# Altium schematic sheet Main.SchDoc
size A2
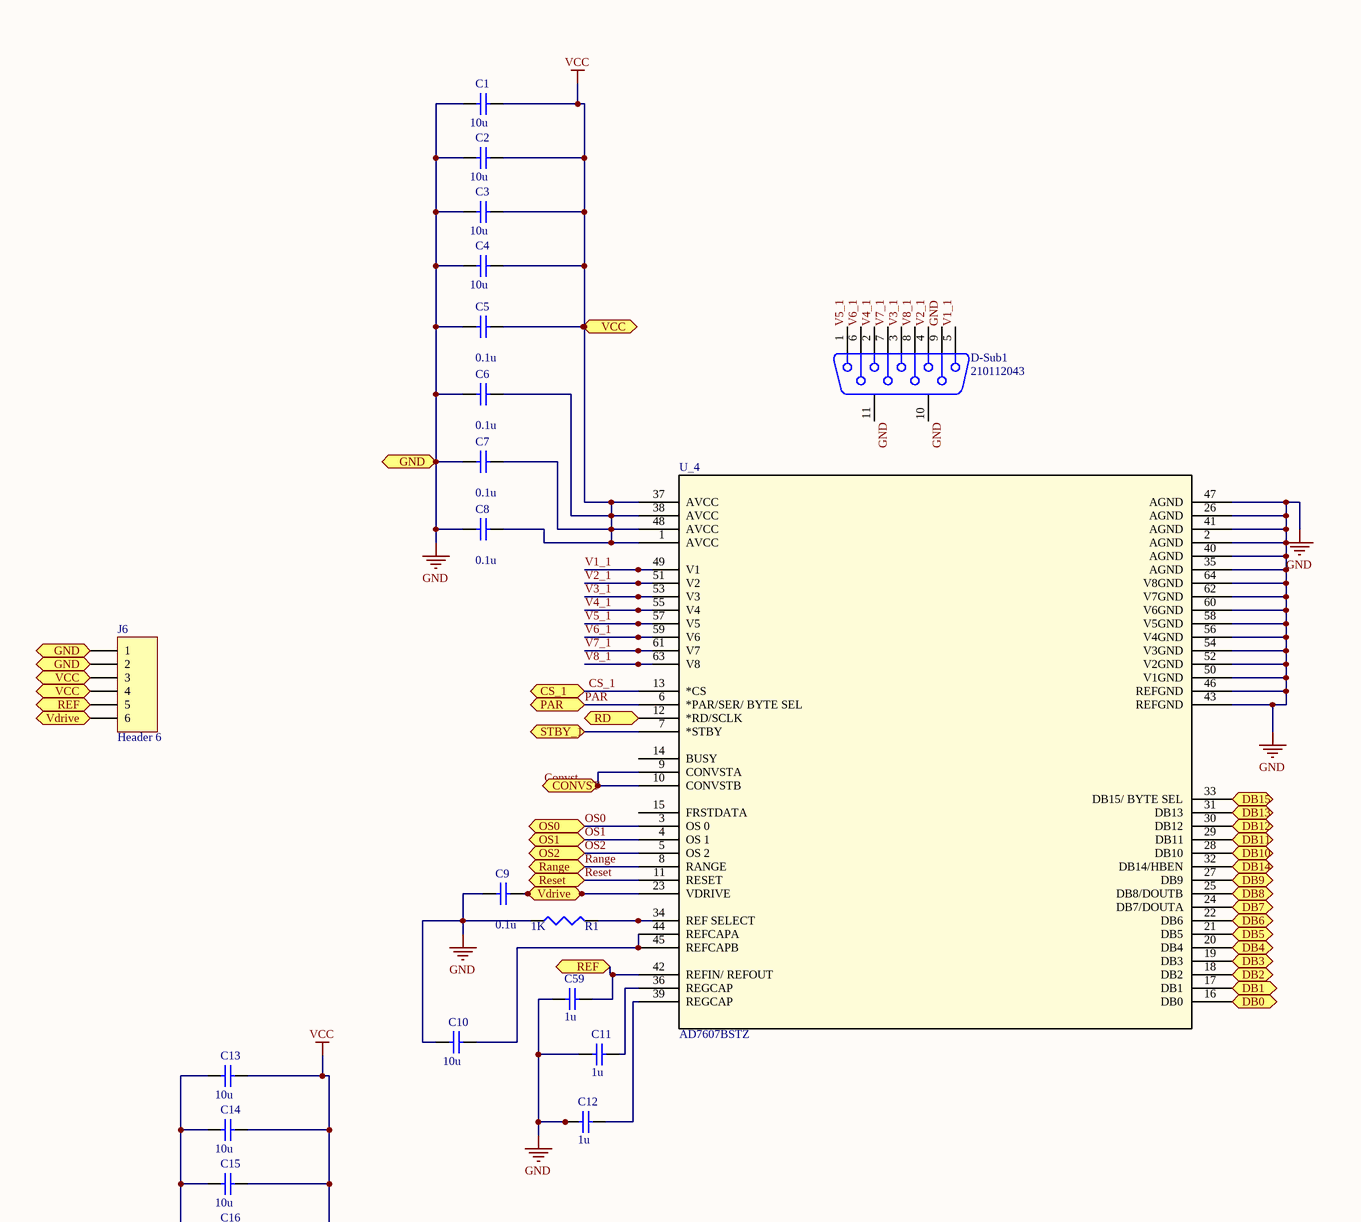
[diagram p0: Main.SchDoc, top left]
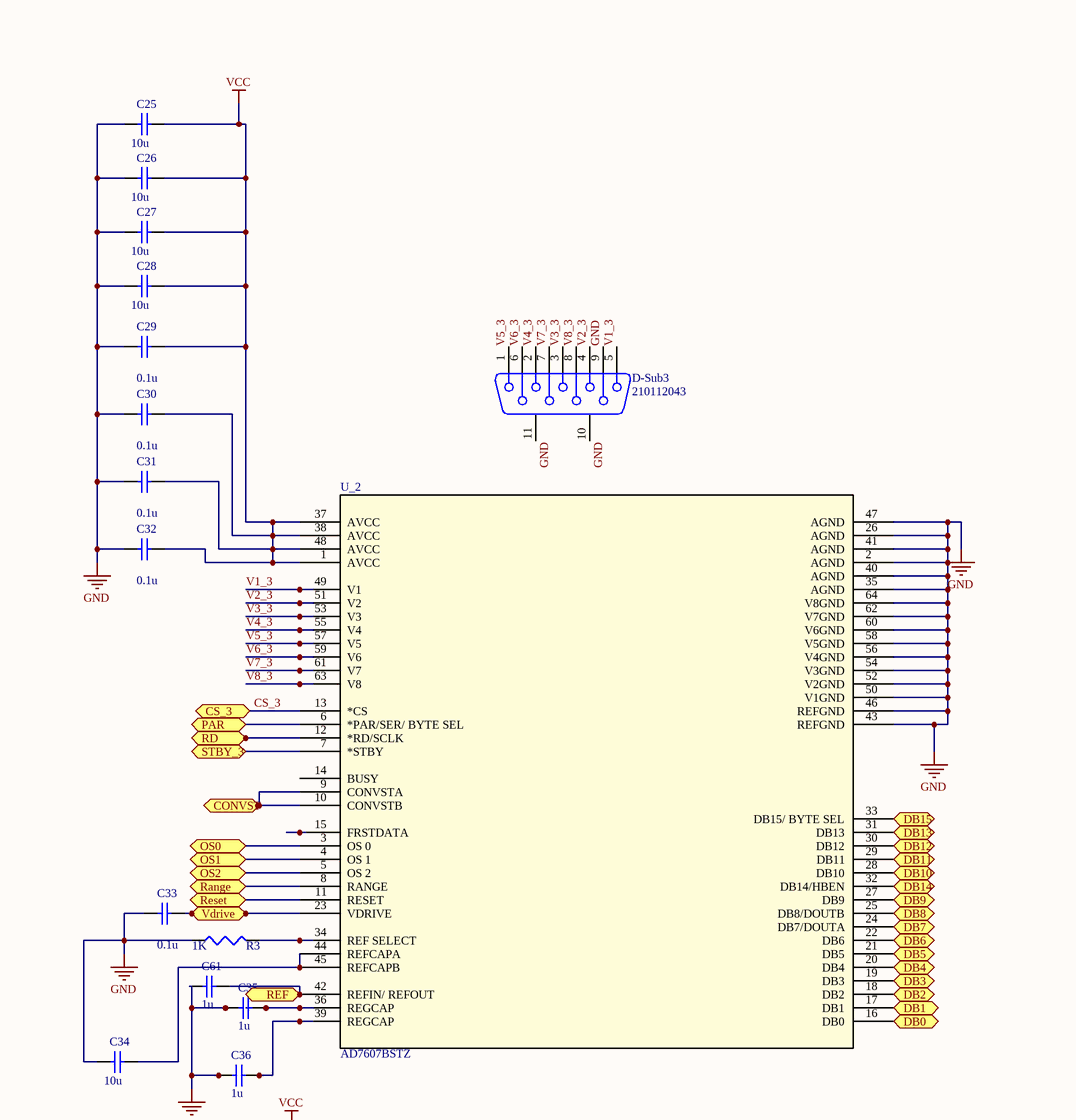
[diagram p1: Main.SchDoc, top right]
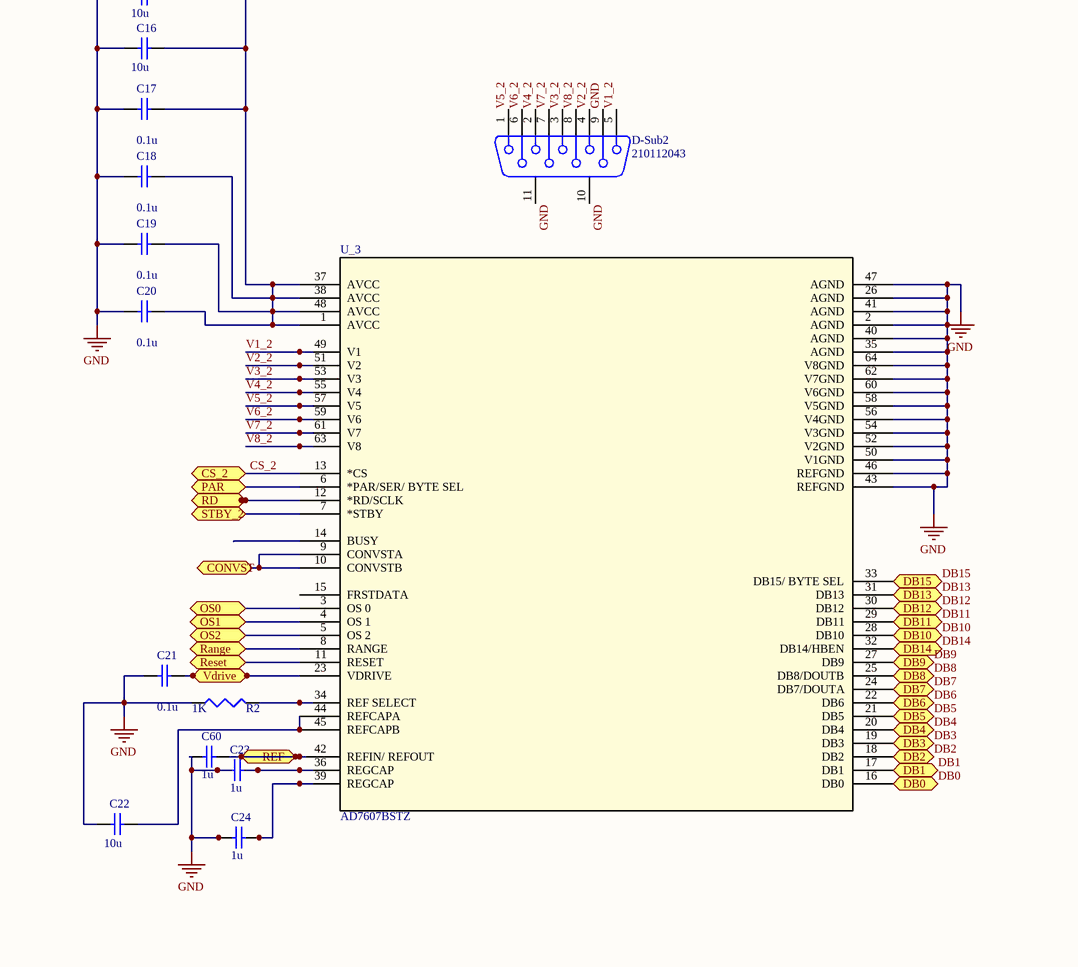
[diagram p2: Main.SchDoc, bottom left]
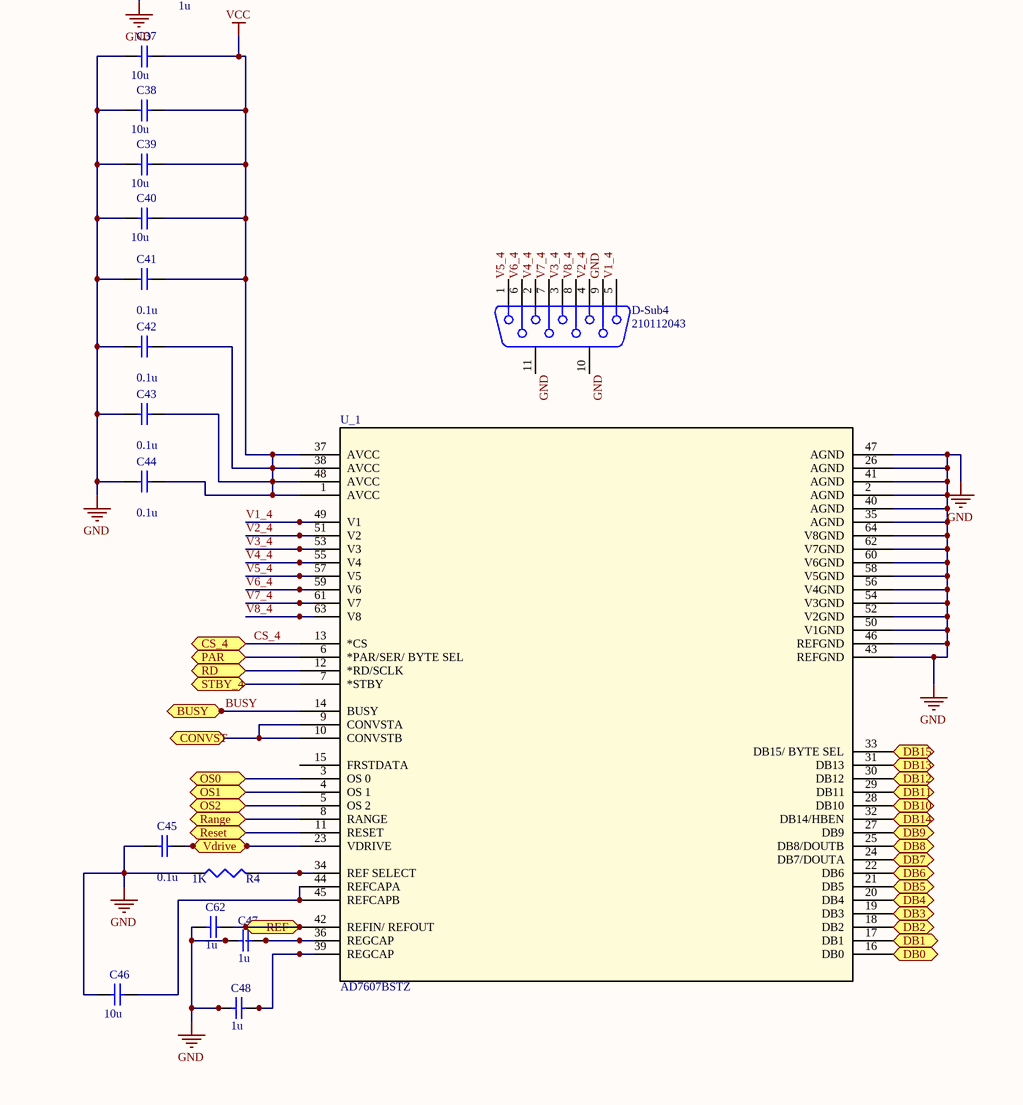
[diagram p3: Main.SchDoc, bottom right]

## Parts
C1  value 10u  [0805]  (hidden comment: C0805)
C2  value 10u  [0805]  (hidden comment: C0805)
C3  value 10u  [0805]  (hidden comment: C0805)
C4  value 10u  [0805]  (hidden comment: C0805)
C5  value 0.1u  [0603]
C6  value 0.1u  [0603]
C7  value 0.1u  [0603]
C8  value 0.1u  [0603]
C9  value 0.1u  [0603]
C10  value 10u  [0805]  (hidden comment: C0805)
C11  value 1u  [0805]  (hidden comment: C0805)
C12  value 1u  [0805]  (hidden comment: C0805)
C13  value 10u  [0805]  (hidden comment: C0805)
C14  value 10u  [0805]  (hidden comment: C0805)
C15  value 10u  [0805]  (hidden comment: C0805)
C16  value 10u  [0805]  (hidden comment: C0805)
C17  value 0.1u  [0603]
C18  value 0.1u  [0603]
C19  value 0.1u  [0603]
C20  value 0.1u  [0603]
C21  value 0.1u  [0603]
C22  value 10u  [0805]  (hidden comment: C0805)
C23  value 1u  [0805]  (hidden comment: C0805)
C24  value 1u  [0805]  (hidden comment: C0805)
C25  value 10u  [0805]  (hidden comment: C0805)
C26  value 10u  [0805]  (hidden comment: C0805)
C27  value 10u  [0805]  (hidden comment: C0805)
C28  value 10u  [0805]  (hidden comment: C0805)
C29  value 0.1u  [0603]
C30  value 0.1u  [0603]
C31  value 0.1u  [0603]
C32  value 0.1u  [0603]
C33  value 0.1u  [0603]
C34  value 10u  [0805]  (hidden comment: C0805)
C35  value 1u  [0805]  (hidden comment: C0805)
C36  value 1u  [0805]  (hidden comment: C0805)
C37  value 10u  [0805]  (hidden comment: C0805)
C38  value 10u  [0805]  (hidden comment: C0805)
C39  value 10u  [0805]  (hidden comment: C0805)
C40  value 10u  [0805]  (hidden comment: C0805)
C41  value 0.1u  [0603]
C42  value 0.1u  [0603]
C43  value 0.1u  [0603]
C44  value 0.1u  [0603]
C45  value 0.1u  [0603]
C46  value 10u  [0805]  (hidden comment: C0805)
C47  value 1u  [0805]  (hidden comment: C0805)
C48  value 1u  [0805]  (hidden comment: C0805)
C59  value 1u  [0805]  (hidden comment: C0805)
C60  value 1u  [0805]  (hidden comment: C0805)
C61  value 1u  [0805]  (hidden comment: C0805)
C62  value 1u  [0805]  (hidden comment: C0805)
D-Sub1  210112043  [WE-DS, 210112043]
D-Sub2  210112043  [WE-DS, 210112043]
D-Sub3  210112043  [WE-DS, 210112043]
D-Sub4  210112043  [WE-DS, 210112043]
J6  Header 6  [HDR1X6]
R1  value 1K  [J1-0603]
R2  value 1K  [J1-0603]
R3  value 1K  [J1-0603]
R4  value 1K  [J1-0603]
U_1  AD7607BSTZ  [ST_64_2]
U_2  AD7607BSTZ  [ST_64_2]
U_3  AD7607BSTZ  [ST_64_2]
U_4  AD7607BSTZ  [ST_64_2]

## Ports
BUSY, CONVST, CS_1, CS_2, CS_3, CS_4, DB0, DB1, DB2, DB3, DB4, DB5, DB6, DB7, DB8, DB9, DB10, DB11, DB12, DB13, DB14, DB15, GND, OS0, OS1, OS2, PAR, Range, RD, REF, Reset, STBY_1, STBY_2, STBY_3, STBY_4, VCC, Vdrive

## Nets
GND: C1.2 C2.2 C3.2 C4.2 C5.1 C6.1 C7.1 C8.1 C9.1 C10.2 C11.2 C12.2 C13.2 C14.2 C15.2 C16.2 C17.1 C18.1 C19.1 C20.1 C21.1 C22.2 C23.2 C24.2 C25.2 C26.2 C27.2 C28.2 C29.1 C30.1 C31.1 C32.1 C33.1 C34.2 C35.2 C36.2 C37.2 C38.2 C39.2 C40.2 C41.1 C42.1 C43.1 C44.1 C45.1 C46.2 C47.2 C48.2 C59.2 C60.2 C61.2 C62.2 D-Sub1.9 D-Sub1.10(MH1) D-Sub1.11(MH2) D-Sub2.9 D-Sub2.10(MH1) D-Sub2.11(MH2) D-Sub3.9 D-Sub3.10(MH1) D-Sub3.11(MH2) D-Sub4.9 D-Sub4.10(MH1) D-Sub4.11(MH2) J6.1 J6.2 R1.1 R2.1 R3.1 R4.1 U_1.2(AGND) U_1.26(AGND) U_1.35(AGND) U_1.40(AGND) U_1.41(AGND) U_1.43(REFGND) U_1.46(REFGND) U_1.47(AGND) U_1.50(V1GND) U_1.52(V2GND) U_1.54(V3GND) U_1.56(V4GND) U_1.58(V5GND) U_1.60(V6GND) U_1.62(V7GND) U_1.64(V8GND) U_2.2(AGND) U_2.26(AGND) U_2.35(AGND) U_2.40(AGND) U_2.41(AGND) U_2.43(REFGND) U_2.46(REFGND) U_2.47(AGND) U_2.50(V1GND) U_2.52(V2GND) U_2.54(V3GND) U_2.56(V4GND) U_2.58(V5GND) U_2.60(V6GND) U_2.62(V7GND) U_2.64(V8GND) U_3.2(AGND) U_3.26(AGND) U_3.35(AGND) U_3.40(AGND) U_3.41(AGND) U_3.43(REFGND) U_3.46(REFGND) U_3.47(AGND) U_3.50(V1GND) U_3.52(V2GND) U_3.54(V3GND) U_3.56(V4GND) U_3.58(V5GND) U_3.60(V6GND) U_3.62(V7GND) U_3.64(V8GND) U_4.2(AGND) U_4.26(AGND) U_4.35(AGND) U_4.40(AGND) U_4.41(AGND) U_4.43(REFGND) U_4.46(REFGND) U_4.47(AGND) U_4.50(V1GND) U_4.52(V2GND) U_4.54(V3GND) U_4.56(V4GND) U_4.58(V5GND) U_4.60(V6GND) U_4.62(V7GND) U_4.64(V8GND) ; port GND
VCC: C1.1 C2.1 C3.1 C4.1 C5.2 C6.2 C7.2 C8.2 C13.1 C14.1 C15.1 C16.1 C17.2 C18.2 C19.2 C20.2 C25.1 C26.1 C27.1 C28.1 C29.2 C30.2 C31.2 C32.2 C37.1 C38.1 C39.1 C40.1 C41.2 C42.2 C43.2 C44.2 J6.3 J6.4 U_1.1(AVCC) U_1.37(AVCC) U_1.38(AVCC) U_1.48(AVCC) U_2.1(AVCC) U_2.37(AVCC) U_2.38(AVCC) U_2.48(AVCC) U_3.1(AVCC) U_3.37(AVCC) U_3.38(AVCC) U_3.48(AVCC) U_4.1(AVCC) U_4.37(AVCC) U_4.38(AVCC) U_4.48(AVCC) ; port VCC
BUSY: U_1.14(BUSY) ; port BUSY
CONVST: U_1.9(CONVSTA) U_1.10(CONVSTB) U_2.9(CONVSTA) U_2.10(CONVSTB) U_3.9(CONVSTA) U_3.10(CONVSTB) U_4.9(CONVSTA) U_4.10(CONVSTB) ; port CONVST
CS_1: U_4.13(*CS) ; port CS_1
CS_2: U_3.13(*CS) ; port CS_2
CS_3: U_2.13(*CS) ; port CS_3
CS_4: U_1.13(*CS) ; port CS_4
DB0: U_1.16(DB0) U_2.16(DB0) U_3.16(DB0) U_4.16(DB0) ; port DB0
DB1: U_1.17(DB1) U_2.17(DB1) U_3.17(DB1) U_4.17(DB1) ; port DB1
DB2: U_1.18(DB2) U_2.18(DB2) U_3.18(DB2) U_4.18(DB2) ; port DB2
DB3: U_1.19(DB3) U_2.19(DB3) U_3.19(DB3) U_4.19(DB3) ; port DB3
DB4: U_1.20(DB4) U_2.20(DB4) U_3.20(DB4) U_4.20(DB4) ; port DB4
DB5: U_1.21(DB5) U_2.21(DB5) U_3.21(DB5) U_4.21(DB5) ; port DB5
DB6: U_1.22(DB6) U_2.22(DB6) U_3.22(DB6) U_4.22(DB6) ; port DB6
DB7: U_1.24(DB7/DOUTA) U_2.24(DB7/DOUTA) U_3.24(DB7/DOUTA) U_4.24(DB7/DOUTA) ; port DB7
DB8: U_1.25(DB8/DOUTB) U_2.25(DB8/DOUTB) U_3.25(DB8/DOUTB) U_4.25(DB8/DOUTB) ; port DB8
DB9: U_1.27(DB9) U_2.27(DB9) U_3.27(DB9) U_4.27(DB9) ; port DB9
DB10: U_1.28(DB10) U_2.28(DB10) U_3.28(DB10) U_4.28(DB10) ; port DB10
DB11: U_1.29(DB11) U_2.29(DB11) U_3.29(DB11) U_4.29(DB11) ; port DB11
DB12: U_1.30(DB12) U_2.30(DB12) U_3.30(DB12) U_4.30(DB12) ; port DB12
DB13: U_1.31(DB13) U_2.31(DB13) U_3.31(DB13) U_4.31(DB13) ; port DB13
DB14: U_1.32(DB14/HBEN) U_2.32(DB14/HBEN) U_3.32(DB14/HBEN) U_4.32(DB14/HBEN) ; port DB14
DB15: U_1.33(DB15/_BYTE_SEL) U_2.33(DB15/_BYTE_SEL) U_3.33(DB15/_BYTE_SEL) U_4.33(DB15/_BYTE_SEL) ; port DB15
OS0: U_1.3(OS_0) U_2.3(OS_0) U_3.3(OS_0) U_4.3(OS_0) ; port OS0
OS1: U_1.4(OS_1) U_2.4(OS_1) U_3.4(OS_1) U_4.4(OS_1) ; port OS1
OS2: U_1.5(OS_2) U_2.5(OS_2) U_3.5(OS_2) U_4.5(OS_2) ; port OS2
PAR: U_1.6(*PAR/SER/_BYTE_SEL) U_2.6(*PAR/SER/_BYTE_SEL) U_3.6(*PAR/SER/_BYTE_SEL) U_4.6(*PAR/SER/_BYTE_SEL) ; port PAR
Range: U_1.8(RANGE) U_2.8(RANGE) U_3.8(RANGE) U_4.8(RANGE) ; port Range
RD: U_1.12(*RD/SCLK) U_2.12(*RD/SCLK) U_3.12(*RD/SCLK) U_4.12(*RD/SCLK) ; port RD
REF: C59.1 C60.1 C61.1 C62.1 J6.5 U_1.42(REFIN/_REFOUT) U_2.42(REFIN/_REFOUT) U_3.42(REFIN/_REFOUT) U_4.42(REFIN/_REFOUT) ; port REF
Reset: U_1.11(RESET) U_2.11(RESET) U_3.11(RESET) U_4.11(RESET) ; port Reset
STBY_1: U_4.7(*STBY) ; port STBY_1
STBY_2: U_3.7(*STBY) ; port STBY_2
STBY_3: U_2.7(*STBY) ; port STBY_3
STBY_4: U_1.7(*STBY) ; port STBY_4
V1_1: D-Sub1.5 U_4.49(V1)
V1_2: D-Sub2.5 U_3.49(V1)
V1_3: D-Sub3.5 U_2.49(V1)
V1_4: D-Sub4.5 U_1.49(V1)
V2_1: D-Sub1.4 U_4.51(V2)
V2_2: D-Sub2.4 U_3.51(V2)
V2_3: D-Sub3.4 U_2.51(V2)
V2_4: D-Sub4.4 U_1.51(V2)
V3_1: D-Sub1.3 U_4.53(V3)
V3_2: D-Sub2.3 U_3.53(V3)
V3_3: D-Sub3.3 U_2.53(V3)
V3_4: D-Sub4.3 U_1.53(V3)
V4_1: D-Sub1.2 U_4.55(V4)
V4_2: D-Sub2.2 U_3.55(V4)
V4_3: D-Sub3.2 U_2.55(V4)
V4_4: D-Sub4.2 U_1.55(V4)
V5_1: D-Sub1.1 U_4.57(V5)
V5_2: D-Sub2.1 U_3.57(V5)
V5_3: D-Sub3.1 U_2.57(V5)
V5_4: D-Sub4.1 U_1.57(V5)
V6_1: D-Sub1.6 U_4.59(V6)
V6_2: D-Sub2.6 U_3.59(V6)
V6_3: D-Sub3.6 U_2.59(V6)
V6_4: D-Sub4.6 U_1.59(V6)
V7_1: D-Sub1.7 U_4.61(V7)
V7_2: D-Sub2.7 U_3.61(V7)
V7_3: D-Sub3.7 U_2.61(V7)
V7_4: D-Sub4.7 U_1.61(V7)
V8_1: D-Sub1.8 U_4.63(V8)
V8_2: D-Sub2.8 U_3.63(V8)
V8_3: D-Sub3.8 U_2.63(V8)
V8_4: D-Sub4.8 U_1.63(V8)
Vdrive: C9.2 C21.2 C33.2 C45.2 J6.6 U_1.23(VDRIVE) U_2.23(VDRIVE) U_3.23(VDRIVE) U_4.23(VDRIVE) ; port Vdrive
NetC10_1: C10.1 U_4.44(REFCAPA) U_4.45(REFCAPB)
NetC11_1: C11.1 U_4.36(REGCAP)
NetC12_1: C12.1 U_4.39(REGCAP)
NetC22_1: C22.1 U_3.44(REFCAPA) U_3.45(REFCAPB)
NetC23_1: C23.1 U_3.36(REGCAP)
NetC24_1: C24.1 U_3.39(REGCAP)
NetC34_1: C34.1 U_2.44(REFCAPA) U_2.45(REFCAPB)
NetC35_1: C35.1 U_2.36(REGCAP)
NetC36_1: C36.1 U_2.39(REGCAP)
NetC46_1: C46.1 U_1.44(REFCAPA) U_1.45(REFCAPB)
NetC47_1: C47.1 U_1.36(REGCAP)
NetC48_1: C48.1 U_1.39(REGCAP)
NetR1_2: R1.2 U_4.34(REF_SELECT)
NetR2_2: R2.2 U_3.34(REF_SELECT)
NetR3_2: R3.2 U_2.34(REF_SELECT)
NetR4_2: R4.2 U_1.34(REF_SELECT)

Not connected (* = marked no-connect by the designer): U_1 15(FRSTDATA); U_2 14(BUSY) 15(FRSTDATA); U_3 14(BUSY) 15(FRSTDATA); U_4 14(BUSY) 15(FRSTDATA)

## Notes on the sheet
- Labels drawn without touching a wire or pin: Convst

## Library data of the parts
C1-C4 C10-C16 C22-C28 C34-C40 C46-C48 C59-C62 = C0805: Ceramic Chip Capacitor - Standard; Note: Footprint corresponds to dimensions for bulk cassette packaging. This case size has tightened tolerances.; Published: 17-Jul-2002; LatestRevisionDate: 19-Mar-2004; LatestRevisionNote: Silkscreen size reduced.; DatasheetDocument: Mar-2001; PackageDocument: Mar-2001; PackageReference: 0805; Publisher: Altium Limited; Code_JEITA: 0805; Code_IPC: 2012[0805]; ComponentLink1Description: Manufacturer Link; ComponentLink1URL: http://www.kemet.com/; ComponentLink2Description: Datasheet; ComponentLink2URL: http://www.kemet.com/kemet/web/homepage/kechome.nsf/vapubfilesname/F3102TA.pdf/$file/F3102TA.pdf
C5-C9 C17-C21 C29-C33 C41-C45 = C0603: Ceramic Chip Capacitor - Standard; Note: Footprint corresponds to dimensions for bulk cassette packaging. This case size has tightened tolerances.; ComponentLink1Description: Manufacturer Link; ComponentLink1URL: http://www.kemet.com/; ComponentLink2Description: Datasheet; ComponentLink2URL: http://www.kemet.com/kemet/web/homepage/kechome.nsf/vapubfilesname/F3102TA.pdf/$file/F3102TA.pdf; Published: 17-Jul-2002; LatestRevisionDate: 19-Mar-2004; LatestRevisionNote: Silkscreen size reduced.; DatasheetDocument: Mar-2001; PackageDocument: Mar-2001; PackageReference: 0603; Publisher: Altium Limited; Code_JEITA: 0603; Code_IPC: 1608 [0603]
D-Sub1-D-Sub4 = WE-DS, 210112043: D-SUB-Filter Connectors WE-DS, Bent 90°,TH; Manufacturer: Würth Elektronik eiSos GmbH; partNo: 210112043; ComponentLink1Description: Manufacturer; ComponentLink1URL: http://www.we-online.de; Created by: Christin Zierenner; Created Date: May 2012; ComponentLink2Description: Datasheet; ComponentLink2URL: http://katalog.we-online.de/kataloge/eisos/index.php?language=en&pf=Filter_abgewinkelt
J6 = Header 6: Header, 6-Pin; LatestRevisionDate: 17-Jul-2002; LatestRevisionNote: Re-released for DXP Platform.; Publisher: Altium Limited
R1-R4 = Res3: Resistor; Published: 8-Jun-2000; LatestRevisionDate: 29-May-2009; LatestRevisionNote: IPC-7351 Footprint Added.; PackageReference: J1-0603; Publisher: Altium Limited; PackageDescription: Chip Resistor
U_1-U_4 = AD7607BSTZ: Imported; Value: Value; Type: Type; RefDes: RefDes